# EAGLE design Motor Double Board (EAGLE 8.7.0)
CNAME: Franks FlightSim Boards; CPROJECT: Franks FlightSim Boards; CREVISION: v0.1; DESIGNER: Frank van Ierland
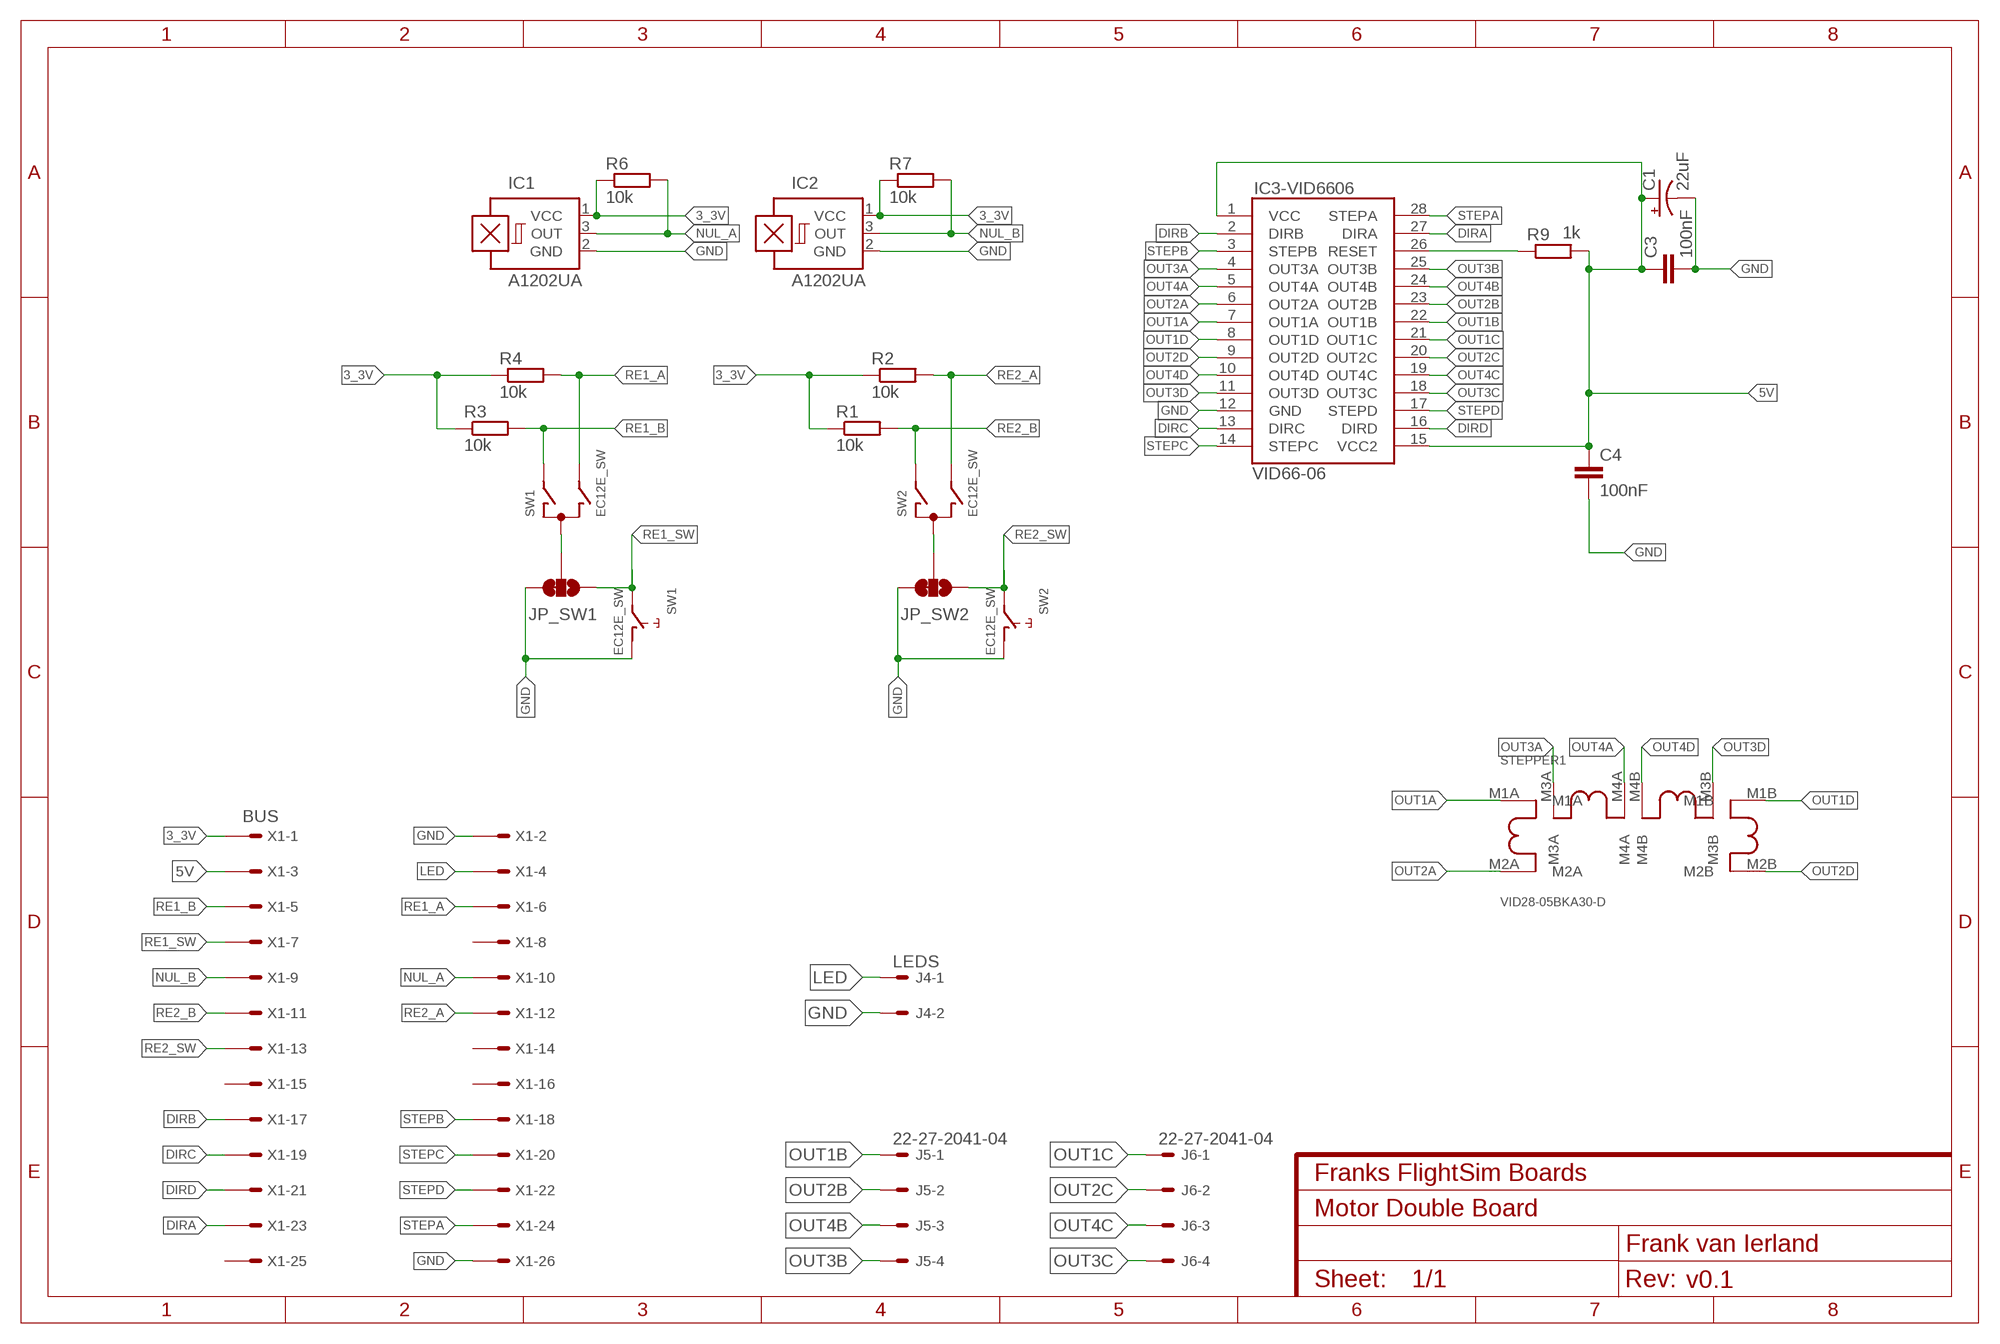
[diagram p0: schematic, sheet 1]

## Parts
C1  22uF  22UF-POLAR-PANASONIC_C-35V-20%  [PANASONIC_C]
C3  100nF  C-EUC0805  [C0805]
C4  100nF  C-EUC0805  [C0805]
IC1  A1202UA  [SIP3-UA]
IC2  A1202UA  [SIP3-UA]
IC3-VID6606  VID66-06  [SO28W]
J4  LEDS  22-27-2021-02  [6410-02]
J5  22-27-2041-04  [6410-04]
J6  22-27-2041-04  [6410-04]
JP_SW1  JUMPER-SMT_3_1-NC_TRACE_SILK  [SMT-JUMPER_3_1-NC_TRACE_SILK]
JP_SW2  JUMPER-SMT_3_1-NC_TRACE_SILK  [SMT-JUMPER_3_1-NC_TRACE_SILK]
R1  10k  R-EU_M1206  [M1206]
R2  10k  R-EU_M1206  [M1206]
R3  10k  R-EU_M1206  [M1206]
R4  10k  R-EU_M1206  [M1206]
R6  10k  R-EU_M1206  [M1206]
R7  10k  R-EU_M1206  [M1206]
R9  1k  R-EU_M1206  [M1206]
STEPPER1  VID28-05BKA30-D  [BKA30D-R5-BACK-DUAL]
SW1  EC12E_SW  [ALPS_EC12E_SW]
SW2  EC12E_SW  [ALPS_EC12E_SW]
X1  BUS  057-026-1  [057-026-1]

## Nets
3_3V [3_3V]: IC1.1(VCC) IC2.1(VCC) R1.1 R2.1 R3.1 R4.1 R6.1 R7.1 X1.1
5V [5V]: C1.+ C3.1 C4.1 IC3-VID6606.1(VCC) IC3-VID6606.15(VCC2) R9.2 X1.3
DIRA: IC3-VID6606.27(DIRA) X1.23
DIRB: IC3-VID6606.2(DIRB) X1.17
DIRC: IC3-VID6606.13(DIRC) X1.19
DIRD: IC3-VID6606.16(DIRD) X1.21
GND [GND]: C1.- C3.2 C4.2 IC1.2(GND) IC2.2(GND) IC3-VID6606.12(GND) J4.2 JP_SW1.3 JP_SW2.3 SW1.D SW2.D X1.2 X1.26
LED [LED]: J4.1 X1.4
N$1: JP_SW2.2 SW2.C
N$8: JP_SW1.2 SW1.C
N$15: IC3-VID6606.26(RESET) R9.1
NUL_A: IC1.3(OUT) R6.2 X1.10
NUL_B: IC2.3(OUT) R7.2 X1.9
OUT1A: IC3-VID6606.7(OUT1A) STEPPER1.M1A
OUT1B: IC3-VID6606.22(OUT1B) J5.1
OUT1C: IC3-VID6606.21(OUT1C) J6.1
OUT1D: IC3-VID6606.8(OUT1D) STEPPER1.M1B
OUT2A: IC3-VID6606.6(OUT2A) STEPPER1.M2A
OUT2B: IC3-VID6606.23(OUT2B) J5.2
OUT2C: IC3-VID6606.20(OUT2C) J6.2
OUT2D: IC3-VID6606.9(OUT2D) STEPPER1.M2B
OUT3A: IC3-VID6606.4(OUT3A) STEPPER1.M3A
OUT3B: IC3-VID6606.25(OUT3B) J5.4
OUT3C: IC3-VID6606.18(OUT3C) J6.4
OUT3D: IC3-VID6606.11(OUT3D) STEPPER1.M3B
OUT4A: IC3-VID6606.5(OUT4A) STEPPER1.M4A
OUT4B: IC3-VID6606.24(OUT4B) J5.3
OUT4C: IC3-VID6606.19(OUT4C) J6.3
OUT4D: IC3-VID6606.10(OUT4D) STEPPER1.M4B
RE1_A: R4.2 SW1.B X1.6
RE1_B: R3.2 SW1.A X1.5
RE1_SW: JP_SW1.1 SW1.E X1.7
RE2_A: R2.2 SW2.B X1.12
RE2_B: R1.2 SW2.A X1.11
RE2_SW: JP_SW2.1 SW2.E X1.13
STEPA: IC3-VID6606.28(STEPA) X1.24
STEPB: IC3-VID6606.3(STEPB) X1.18
STEPC: IC3-VID6606.14(STEPC) X1.20
STEPD: IC3-VID6606.17(STEPD) X1.22
Unconnected: SW1.GND1(G) SW1.GND2(G) SW2.GND1(G) SW2.GND2(G) X1.8 X1.14 X1.15 X1.16 X1.25

## Library data of the parts
C1 = SparkFun-Capacitors:22UF-POLAR: 22µF polarized capacitors A capacitor is a passive two-terminal electrical component used to store electrical energy temporarily in an electric field.; PROD_ID: CAP-08618
C3 C4 = rcl:C-EU: CAPACITOR, European symbol; SPICEPREFIX: C
IC1 IC2 = allegro:A12*?: Hall-effect bipolar switch Source: http://www.allegromicro.com/en/Products/Part_Numbers/1202/1202.pdf; OC_FARNELL: unknown; OC_NEWARK: unknown
IC3-VID6606 = Franks:VID66-06: GENERAL DESCRIPTION The quad stepping motor driver VID66-06 is a monolithic CMOS device intended to be used as an interface circuit to ease the use of the stepper motor VID29-XX. It is specifically designed for applications in the car dashboard. The chip allows the user to drive four motors as it contains four identical drivers on the same chip. The driver circuit converts a pulse train f(scx) into a current level sequence sent to the motor coils. This sequence is used to produce the micro stepping movement of the motor. Each inner driver in the chip generates 2 sequent logic pulse signals and provides shaft stepping angle resolution 1/12°. FEATURES -Generates micro steps -Glitch filters on all inputs -VDD = 4.5 to 5.5V -Low EMI emission Link to pdf <http://www.vid.wellgain.com/UploadFile/down/2009111391612_VID6606%20manual%20060927.pdf>
J4 = con-molex:22-?-02: CONNECTOR wire to board 2.54 mm (.1 inch) pitch header; MF: MOLEX; OC_FARNELL: unknown; OC_NEWARK: unknown
J5 J6 = con-molex:22-?-04: CONNECTOR wire to board 2.54 mm (.1 inch) pitch header; MF: MOLEX; OC_FARNELL: unknown; OC_NEWARK: unknown
JP_SW1 JP_SW2 = SparkFun-Jumpers:JUMPER-SMT_3_1-NC_TRACE: Normally closed trace jumper (1 of 2 connections) This jumper has a trace between two pads so it's normally closed (NC). The other connection is normally open (NO). Use a razor knife to open the connection. For best results follow the IPC guidelines for cutting traces: Cutout at least 0.063 mm (0.005 in). Remove all loose material to clean up the cut area. Seal the cut with an approved epoxy. Reapply solder to reclose the connection, or to close the NO connection.
R1-R4 R6 R7 R9 = resistor:R-EU_: RESISTOR, European symbol
STEPPER1 = Franks:VID28-05
SW1 SW2 = switch-alps:EC12E_SW: ALPS rotary Encoder EC12E series with switch; MPN: EC12E2424407; OC_FARNELL: 1520813; OC_NEWARK: 74M1068
X1 = con-panduit:057-026-: CONNECTOR 20-pin series 057 contact pc board low profile headers; OC_FARNELL: unknown; OC_NEWARK: unknown

## Net classes
1 GND: width 0.762 mm
2 VCC: width 0.635 mm
3 LED: width 0.508 mm
4 5V: width 0.508 mm
5 3_3V: width 0.508 mm

## Board
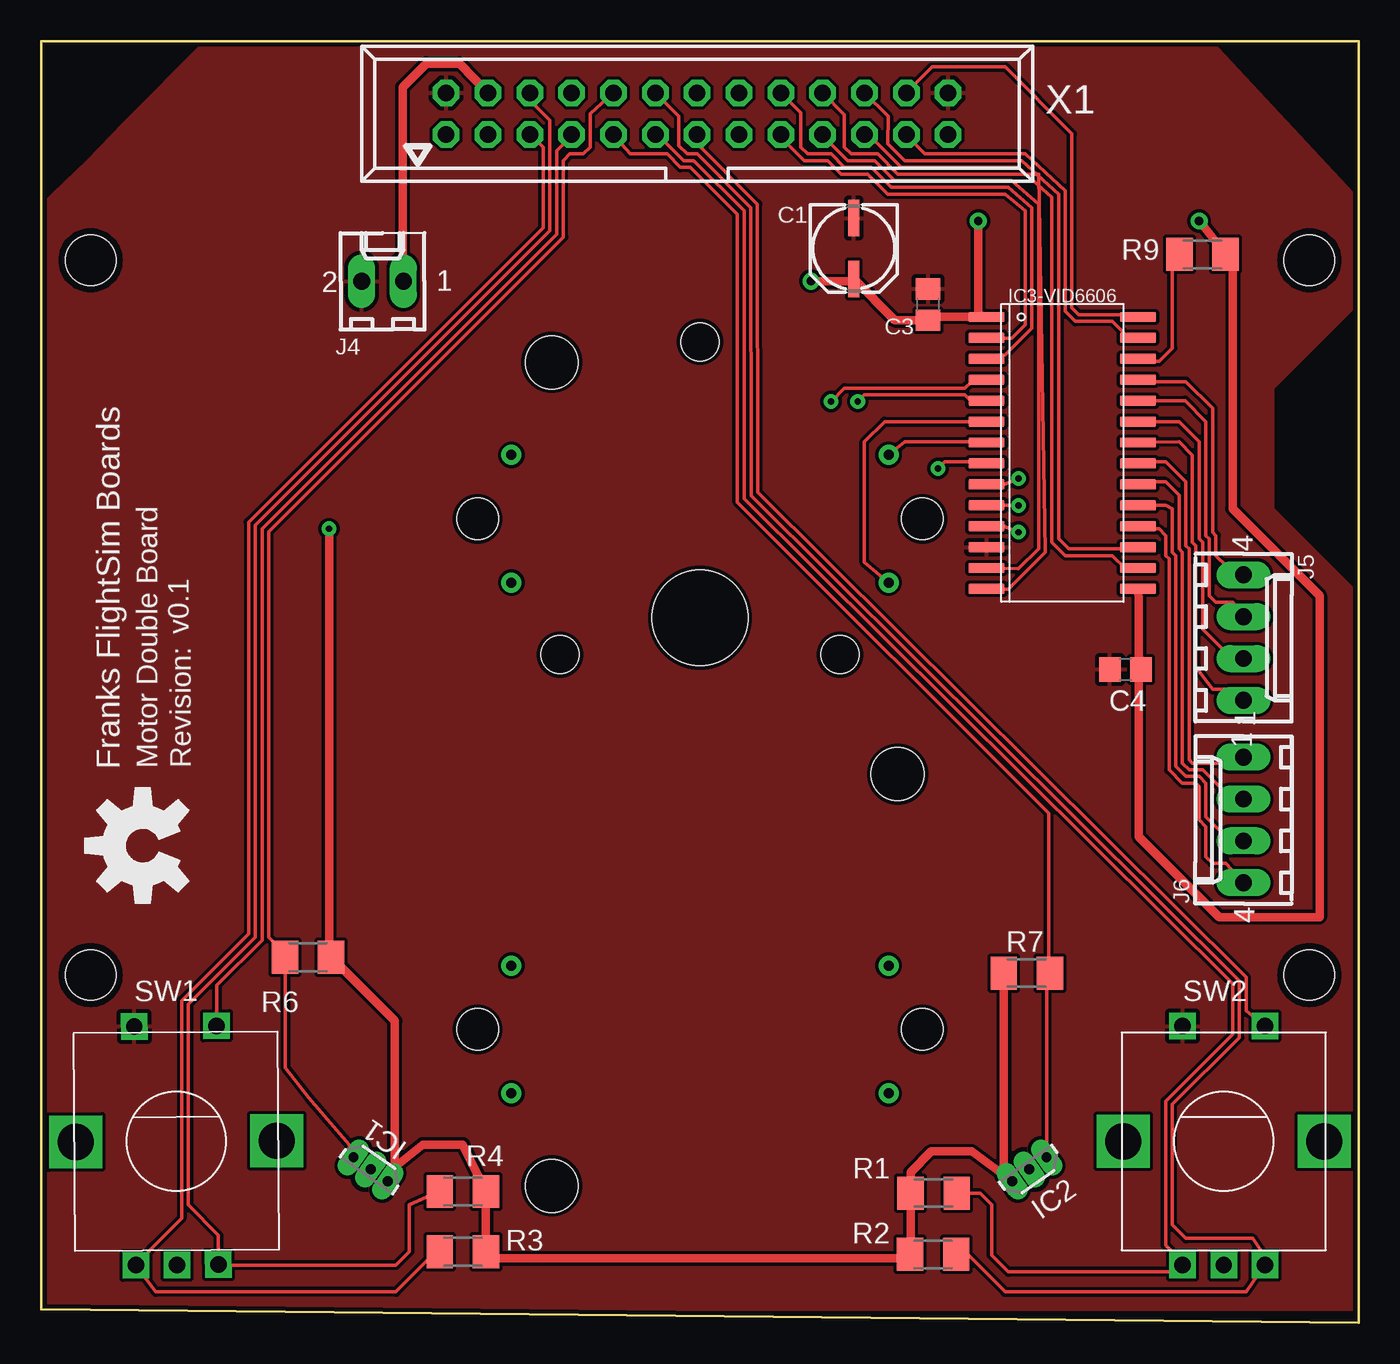
[diagram p1: board, top side]
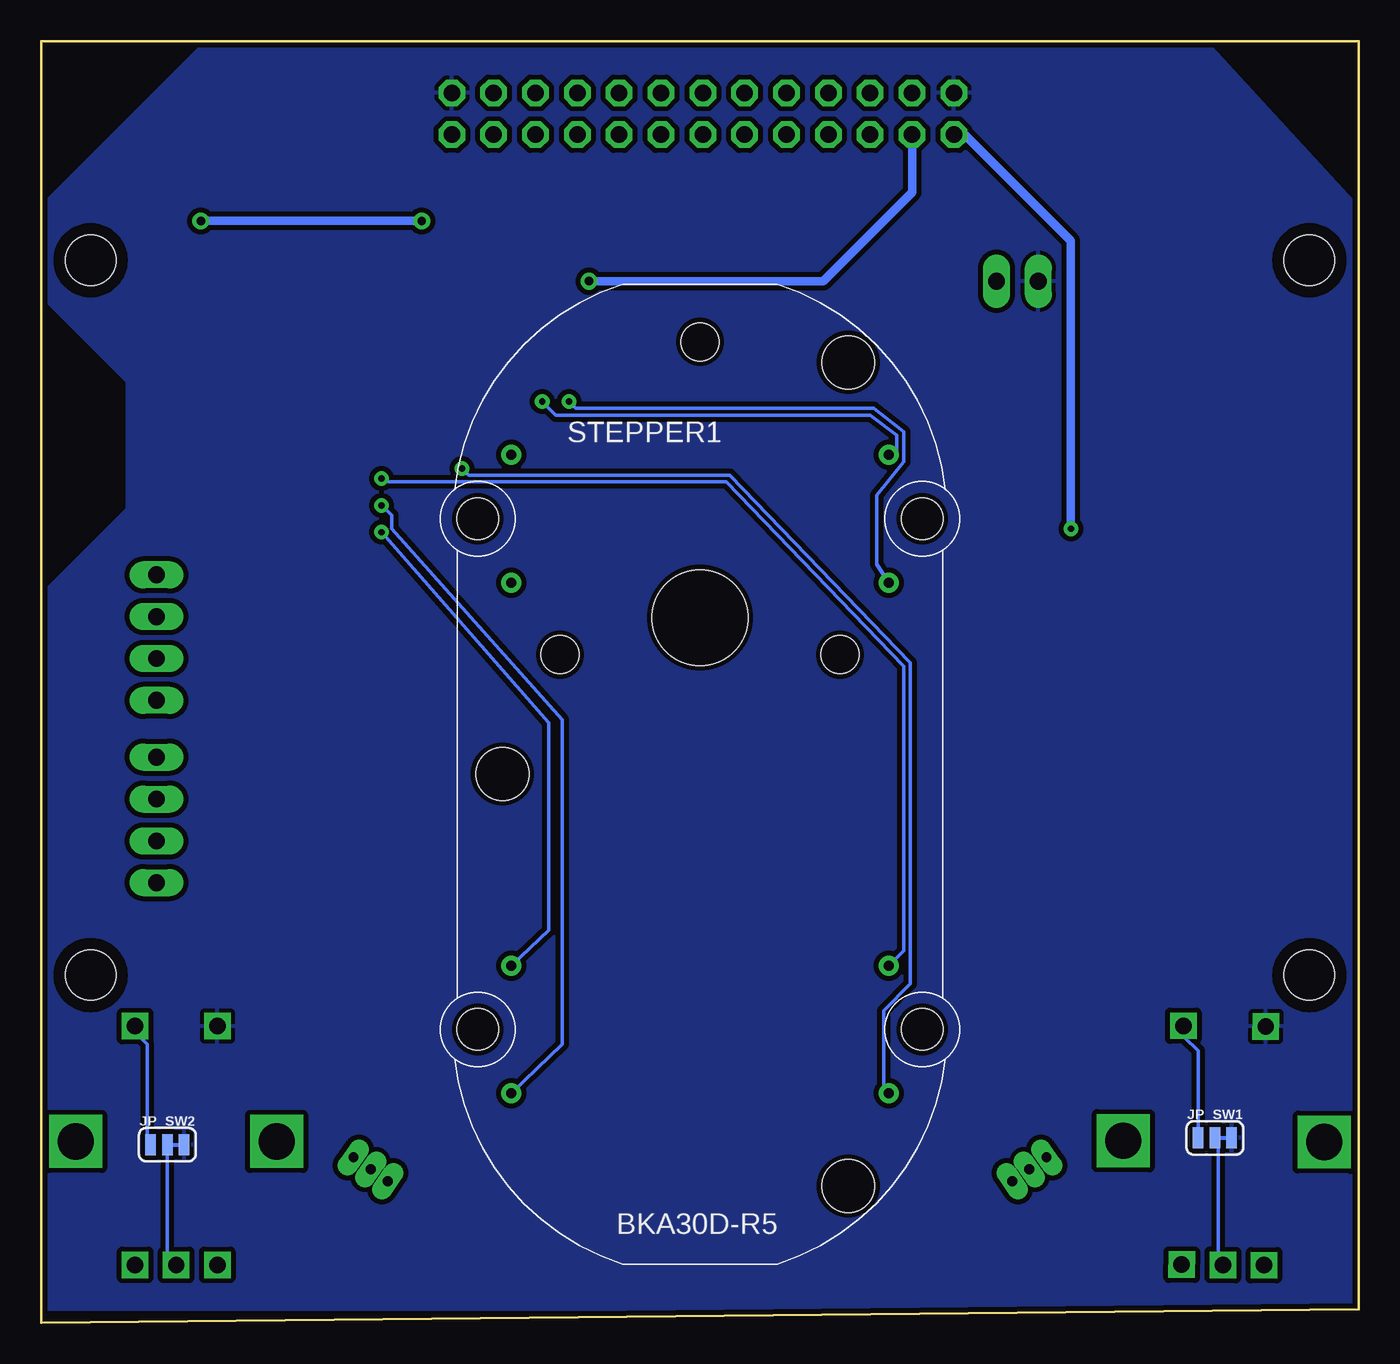
[diagram p2: board, bottom side, seen from below]

Size 80 x 77.81 mm. Coordinates in mm from the lower left corner, seen from the top.
Outline: 0,0.81 80,0 80,77.81 0,77.81 0,0.81
Copper layers (1*16): Top 0.035mm / dielectric 1.5mm / Bottom 0.035mm
Design rules "SparkFun *": minimum track width 8mil, minimum drill 15mil, track to track 8mil, track to pad 8mil, pad to pad 8mil, via to via 8mil, smd to smd 8mil, copper to edge 10mil, drill to drill 8mil, minimum pad ring 12mil, minimum via ring 10mil, stop-mask expansion 4mil, vias tented up to drill 25mil, thermal gap 10mil

### Footprints (pad centres in the part's own frame; a part is rotated, then mirrored left to right if it is on the bottom)
PANASONIC_C = smd 2.2 x 0.65: + 1.9,-0.2; - -1.8,-0.2
C0805 = smd 1.3 x 1.5: 1 -0.95,0; 2 0.95,0
SIP3-UA = drill 0.6 pad 0.7 long: 1 -1.27,0; 2 0,0; 3 1.27,0
SO28W = smd 2.2 x 0.6: 1 -4.6,8.255; 2 -4.6,6.985; 3 -4.6,5.715; 4 -4.6,4.445; 5 -4.6,3.175; 6 -4.6,1.905; 7 -4.6,0.635; 8 -4.6,-0.635; 9 -4.6,-1.905; 10 -4.6,-3.175; 11 -4.6,-4.445; 12 -4.6,-5.715; 13 -4.6,-6.985; 14 -4.6,-8.255; 15 4.6,-8.255; 16 4.6,-6.985; 17 4.6,-5.715; 18 4.6,-4.445; 19 4.6,-3.175; 20 4.6,-1.905; 21 4.6,-0.635; 22 4.6,0.635; 23 4.6,1.905; 24 4.6,3.175; 25 4.6,4.445; 26 4.6,5.715; 27 4.6,6.985; 28 4.6,8.255
6410-02 = drill 1.016 long: 1 1.27,0; 2 -1.27,0
6410-04 = drill 1.016 long: 1 3.81,0; 2 1.27,0; 3 -1.27,0; 4 -3.81,0
SMT-JUMPER_3_1-NC_TRACE_SILK = smd 0.635 x 1.27: 1 -1.016,0; 2 0,0; 3 1.016,0
M1206 = smd 1.6 x 2: 1 -1.4,0; 2 1.4,0
BKA30D-R5-BACK-DUAL = drill 0.6 pad 0.8: M1A -11.45,9.88; M1B 11.45,-28.88; M2A -11.45,2.13; M2B 11.45,-21.13; M3A 11.45,2.13; M3B -11.45,-21.13; M4A 11.45,9.88; M4B -11.45,-28.88 | hole 2.5: 13.5,6; 13.5,-25; -13.5,-25; -13.5,6 | hole 5.8: 0,0 | hole 3.2: 9,-34.5; 9,15.5; -12,-9.5 | hole 2.3: -8.5,-2.25; 8.5,-2.25; 0,16.75
ALPS_EC12E_SW = drill 1 square: A -2.5,-7.5; B 2.5,-7.5; C 0,-7.5; D -2.5,7; E 2.5,7 | drill 2.2 square: GND1 -6.1,0; GND2 6.1,0
STAND-OFF-TIGHT = hole 3.048: 0,0
057-026-1 = drill 1 octagon: 1 -15.24,-1.27; 2 -15.24,1.27; 3 -12.7,-1.27; 4 -12.7,1.27; 5 -10.16,-1.27; 6 -10.16,1.27; 7 -7.62,-1.27; 8 -7.62,1.27; 9 -5.08,-1.27; 10 -5.08,1.27; 11 -2.54,-1.27; 12 -2.54,1.27; 13 0,-1.27; 14 0,1.27; 15 2.54,-1.27; 16 2.54,1.27; 17 5.08,-1.27; 18 5.08,1.27; 19 7.62,-1.27; 20 7.62,1.27; 21 10.16,-1.27; 22 10.16,1.27; 23 12.7,-1.27; 24 12.7,1.27; 25 15.24,-1.27; 26 15.24,1.27

### Placement (x,y rotation side)
C1  49.53,65.28 270 top
C3  53.85,61.82 90 top
C4  65.84,39.67 180 top
IC1  20,9.31 145 top
IC2  60,9.31 35 top
IC3-VID6606  62,52.81 0 top
J4  20.73,63.24 0 top
J5  73,41.6 270 top
J6  73,30.53 90 top
JP_SW1  8.74,11.22 0 bottom
JP_SW2  72.34,10.82 0 bottom
R1  54.19,7.88 0 top
R2  54.16,4.16 0 top
R3  25.6,4.32 180 top
R4  25.6,7.97 180 top
R6  16.21,22.2 180 top
R7  59.84,21.23 0 top
R9  70.51,64.87 0 top
STEPPER1  40,42.81 0 bottom
SW1  8.2,11.01 0.4 top
SW2  71.8,11.01 0 top
U$1  [STAND-OFF-TIGHT]  3,21.11 0 top
U$9  [OSHW-LOGO-L]  6.16,28.97 90 top
U$11  [STAND-OFF-TIGHT]  77,21.11 0 top
U$12  [STAND-OFF-TIGHT]  3,64.51 0 top
U$13  [STAND-OFF-TIGHT]  77,64.51 0 top
X1  39.83,73.4 0 top

### Tracks (layer width: path | path; a pad name or v marks a point on that pad's centre or on a via)
3_3V  (via drill 0.38)
  Top 0.508: v17.48,48.21 17.48,23.01 R6.1 21.47,18.33 21.47,9.38 21.04,8.95 IC1.1 21.04,9.1 23.16,10.82 25.6,10.82 R4.1 R3.1 27.23,3.91 52.43,3.91 52.43,4.31 52.59,4.15 R2.1 52.79,4.59 R1.1 52.79,9.15 54.05,10.41 56.49,10.41 IC2.1 58.44,9.1 R7.1
  Bottom 0.508: v17.48,48.21 17.48,65.68 23.93,72.13 X1.1
5V  (via drill 0.51)
  Top 0.508: v46.74,63.24 49.17,63.24 49.31,63.37 C1.+ 51.83,60.87 C3.1 54.05,61.07 IC3-VID6606.1 56.9,61.21 v56.9,66.9 | v70.31,66.9 R9.2 72.34,64.06 72.34,49.43 77.62,44.14 77.62,24.63 71.53,24.63 66.65,29.51 66.65,38.86 C4.1 66.65,40.48 66.65,43.74 IC3-VID6606.15
  Bottom 0.508: v46.74,63.24 32.51,63.24 27.13,68.63 X1.3 | v56.9,66.9 v70.31,66.9
DIRA
  Top 0.203: IC3-VID6606.27 65.84,59.99 65.02,60.8 62.79,60.8 62.18,61.41 62.18,68.73 59.74,70.96 53.65,70.96 X1.23
DIRB
  Top 0.203: IC3-VID6606.2 57.91,59.79 58.93,59.79 59.74,60.6 59.74,67.51 58.52,68.53 51.41,68.53 50.19,69.75 48.56,69.75 47.75,70.56 46.33,70.56 45.11,71.78 45.11,71.73 X1.17
DIRC
  Top 0.203: IC3-VID6606.13 59.33,45.77 60.55,46.99 60.55,67.92 58.93,69.34 51.82,69.34 50.6,70.56 48.97,70.56 47.75,71.78 X1.19
DIRD
  Top 0.203: IC3-VID6606.16 65.9,45.83 65.84,45.77 65.02,46.58 62.18,46.58 61.37,47.39 61.37,68.32 59.33,70.15 52.22,70.15 50.24,72.13 X1.21
GND
  pour Bottom (isolate 0.305): 69.97,77.81 9.35,77.87 0,67.71 0,0.81 80,0.81 80.06,44.14 74.78,49.43 74.78,57.15 80,62.37 80,67.81 79.65,68.12
  pour Top: 0,67.81 0,0.81 80,0.81 80.06,44.14 74.78,49.43 74.78,56.74 80,61.96 80.06,68.12 79.65,68.53 71,77.81 10,77.81 5,72.81 2.84,70.56
LED
  Top 0.508: J4.1 21.95,64.46 21.95,75.03 23.37,76.45 25.4,76.45 X1.4
N$1
  Bottom 0.203: SW2.C 72.34,4.31 JP_SW2.2
N$8
  Bottom 0.203: JP_SW1.2 8.74,11.02 8.53,10.82 8.53,3.91 SW1.C
N$15
  Top 0.203: IC3-VID6606.26 67.06,58.37 67.87,58.37 68.68,59.18 68.68,64.44 R9.1
NUL_A
  Top 0.203: IC1.3 18.69,10.82 16.26,13.66 14.83,15.49 R6.2 14.8,22.43 13.82,23.42 13.82,48.04 31.7,65.92 31.7,70.56 32.11,70.96 32.92,70.96 33.33,71.37 33.33,73.4 X1.10
NUL_B
  Top 0.203: IC2.3 61.04,21.03 R7.2 61.24,21.67 61.16,22.2 61.16,30.93 42.27,49.83 42.27,67.31 39.42,70.15 38.81,70.15 38,70.96 35.76,70.96 X1.9
OUT1A
  Top 0.203: STEPPER1.M1A 52.43,53.49 56.49,53.49 IC3-VID6606.7
OUT1B
  Top 0.203: J5.1 71.93,38.45 71.12,38.45 70.51,39.27 70.1,39.87 70.1,47.19 69.9,47.39 69.9,52.68 69.09,53.49 IC3-VID6606.22
OUT1C
  Top 0.203: J6.1 72.34,33.98 69.9,33.98 69.7,34.19 69.7,46.99 69.49,47.19 69.49,51.05 68.28,52.27 67.46,52.27 IC3-VID6606.21
OUT1D  (via drill 0.38)
  Top 0.203: v54.46,51.86 54.86,52.27 56.49,52.27 56.58,52.18 IC3-VID6606.8
  Bottom 0.203: v54.46,51.86 54.05,51.46 38.2,51.46 27.23,40.08 27.23,20.57 28.85,18.95 28.85,14.47 STEPPER1.M1B
OUT2A
  Top 0.203: IC3-VID6606.6 56.5,54.72 56.49,54.71 51.21,54.71 49.99,53.49 49.99,46.17 STEPPER1.M2A
OUT2B
  Top 0.203: J5.2 71.73,40.89 70.51,42.11 70.51,47.39 70.31,47.6 70.31,53.49 69.09,54.71 IC3-VID6606.23
OUT2C
  Top 0.203: IC3-VID6606.20 67.3,50.91 66.79,51.02 67.46,51.05 68.28,51.05 69.09,50.24 69.09,46.99 69.29,46.78 69.29,33.98 69.7,33.58 70.51,33.58 71.73,32.36 J6.2
OUT2D  (via drill 0.38)
  Top 0.203: IC3-VID6606.9 58.32,50.85 v59.33,51.25
  Bottom 0.203: v59.33,51.25 59.13,51.25 58.93,51.05 38.41,51.05 27.64,39.87 27.64,22.6 STEPPER1.M2B
OUT3A  (via drill 0.38)
  Top 0.203: v47.95,55.93 48.77,56.74 56.08,56.74 56.49,57.15 IC3-VID6606.4
  Bottom 0.203: v47.95,55.93 47.55,55.52 29.46,55.52 27.64,54.1 27.64,52.27 29.26,50.24 29.26,46.06 STEPPER1.M3A
OUT3B
  Top 0.203: J5.4 71.98,45.92 71.32,46.58 71.32,47.8 71.12,48 71.12,55.52 69.49,57.15 67.46,57.15 IC3-VID6606.25
OUT3C
  Top 0.203: IC3-VID6606.18 67.06,48.21 67.87,48.21 68.28,47.8 68.28,46.58 68.48,46.38 68.48,33.58 69.29,32.76 70.1,32.76 70.31,32.56 70.31,30.53 70.71,30.12 70.71,28.29 71.12,27.89 71.93,27.89 J6.4
OUT3D  (via drill 0.38)
  Top 0.203: IC3-VID6606.11 58.32,48.41 v59.33,48
  Bottom 0.203: v59.33,48 49.17,36.42 49.17,23.82 STEPPER1.M3B
OUT4A  (via drill 0.38)
  Top 0.203: v49.58,55.93 49.99,56.33 56.08,56.33 56.49,55.93 IC3-VID6606.5
  Bottom 0.203: v49.58,55.93 48.77,55.11 29.67,55.11 28.04,53.9 28.04,52.88 STEPPER1.M4A
OUT4B
  Top 0.203: IC3-VID6606.24 69.45,55.99 70.71,54.71 70.71,47.8 70.92,47.6 70.92,44.14 71.32,43.74 72.34,43.74 J5.3
OUT4C
  Top 0.203: J6.3 72.19,29.26 70.71,30.73 70.71,32.76 70.31,33.17 69.49,33.17 68.89,33.78 68.89,46.58 68.68,46.78 68.68,49.43 68.28,49.63 67.26,49.63 IC3-VID6606.19
OUT4D  (via drill 0.38)
  Top 0.203: v59.33,49.63 58.12,49.63 IC3-VID6606.10
  Bottom 0.203: v59.33,49.63 58.73,49.02 58.73,48.21 48.36,36.62 48.36,16.91 STEPPER1.M4B
RE1_A
  Top 0.203: R4.2 22.35,7.16 22.35,4.31 21.54,3.5 11.38,3.5 SW1.B 10.75,5.31 8.94,7.16 8.94,19.35 13.01,23.42 13.01,48.41 30.89,66.29 30.89,73 29.67,74.22 X1.6
RE1_B
  Top 0.203: R3.2 23.57,3.91 21.54,1.88 6.96,1.88 SW1.A 6.91,4.72 8.53,6.35 8.53,19.55 12.6,23.62 12.6,48.61 30.48,66.49 30.48,71.37 29.72,72.13 X1.5
RE1_SW
  Top 0.203: SW1.E 10.65,20.49 13.41,23.21 13.41,48.21 31.29,66.09 31.29,71.17 32.11,71.98 X1.7
  Bottom 0.203: JP_SW1.1 9.75,16.51 10.57,17.32 SW1.E
RE2_A
  Top 0.203: R2.2 56.24,4.15 58.52,1.88 73.15,1.88 SW2.B 74.37,3.91 73.56,5.13 69.49,5.13 68.68,5.94 68.68,13.26 72.75,17.32 72.75,20.77 43.1,50.22 43.08,67.71 39.83,70.96 39.22,70.96 38.72,71.47 38.72,73.24 X1.12
RE2_B
  Top 0.203: R1.2 57.01,7.86 57.71,7.16 57.71,4.11 58.73,3.1 68.68,3.1 69.31,3.31 SW2.A 69.3,3.7 68.28,4.72 68.28,13.46 72.34,17.52 72.34,20.57 42.67,50.03 42.67,67.51 39.62,70.56 39.01,70.56 37.8,71.78 X1.11
RE2_SW
  Top 0.203: SW2.E 73.15,18.95 73.15,20.98 43.51,50.43 43.48,67.92 39.83,71.57 X1.13
  Bottom 0.203: JP_SW2.1 73.56,11.22 73.56,16.91 73.97,17.32 SW2.E
STEPA
  Top 0.203: IC3-VID6606.28 65.98,61.07 65.84,61.21 62.99,61.21 62.59,61.62 62.59,72.18 58.52,76.25 54.1,76.25 X1.24
STEPB
  Top 0.203: IC3-VID6606.3 58.52,58.77 60.15,60.4 60.15,67.71 58.73,68.93 51.61,68.93 50.39,70.15 48.77,70.15 47.95,70.96 46.53,70.96 46.13,71.37 46.13,73.45 X1.18
STEPC
  Top 0.203: IC3-VID6606.14 58.52,44.55 | 58.52,44.55 58.12,44.55 | 58.52,44.55 58.73,44.55 60.96,46.78 60.55,69.75 52.02,69.75 50.8,70.96 49.17,70.96 48.77,71.37 48.77,73.35 X1.20
STEPD
  Top 0.203: IC3-VID6606.17 65.95,47.1 65.84,46.99 62.38,46.99 61.77,47.6 61.77,68.53 59.54,70.56 52.43,70.56 51.41,71.57 51.42,73.24 X1.22

### Text on the board
tNames: Revision: